# Altium schematic sheet EC800M_CN.SchDoc: EC800M_CN
size A3; ApprovedBy: TRAN VAN THANG; Author: MINH NHAT; Revision: 6.6.6; SheetNumber: 2; SheetTotal: 6; ProjectTitle: LOAPAY 4G WIFI
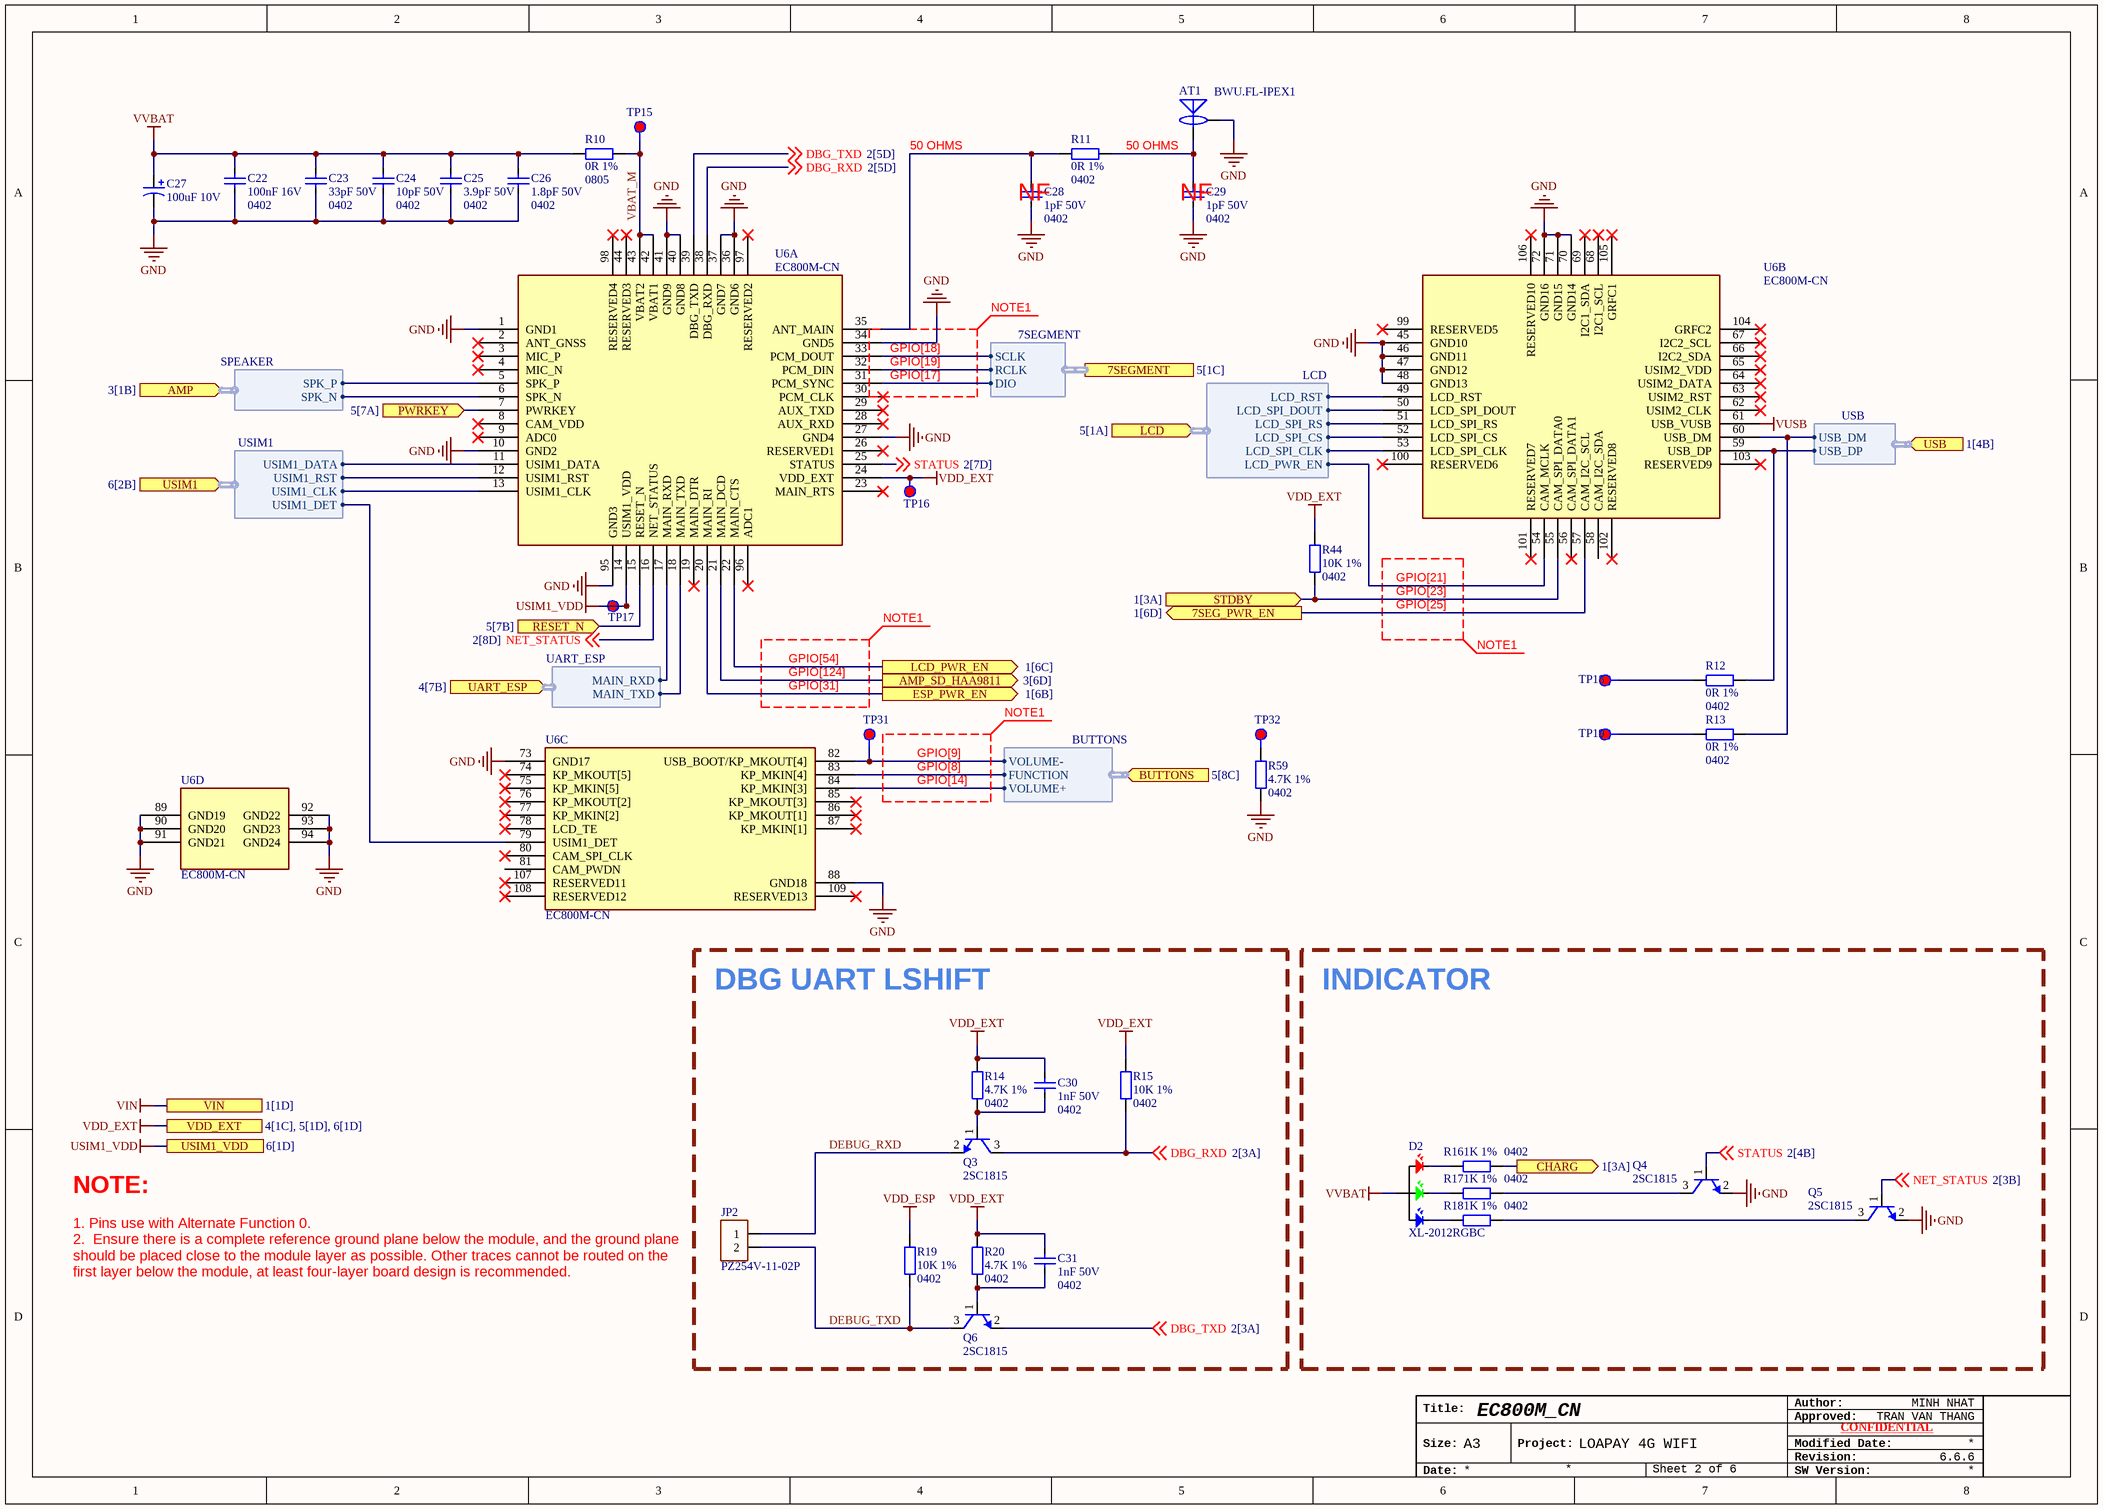
[diagram p0: EC800M_CN.SchDoc]

## Parts
AT1  BWU.FL-IPEX1  [IPEX-SMD_BWIPX-1-001E]
C22  100nF 16V  Package: 0402  [C0402_2]
C23  33pF 50V  Package: 0402  [C0402_2]
C24  10pF 50V  Package: 0402  [C0402_2]
C25  3.9pF 50V  Package: 0402  [C0402_2]
C26  1.8pF 50V  Package: 0402  [C0402_2]
C27  100uF 10V  [CAP-ALU-SMD-C-NEW]
C28  1pF 50V  Package: 0402  [C0402_2]
C29  1pF 50V  Package: 0402  [C0402_2]
C30  1nF 50V  Package: 0402  [C0402_2]
C31  1nF 50V  Package: 0402  [C0402_2]
D2  XL-2012RGBC  [LED-SMD_4P-L2.0-W1.3-BR]
JP2  PZ254V-11-02P  [JP2_M - 2]
Q3  2SC1815  [TF_SOT_23_3]
Q4  2SC1815  [TF_SOT_23_3]
Q5  2SC1815  [TF_SOT_23_3]
Q6  2SC1815  [TF_SOT_23_3]
R10  0R 1%  Package: 0805  [RES_SMD_0805]
R11  0R 1%  Package: 0402  [RES_SMD_0402]
R12  0R 1%  Package: 0402  [RES_SMD_0402]
R13  0R 1%  Package: 0402  [RES_SMD_0402]
R14  4.7K 1%  Package: 0402  [RES_SMD_0402]
R15  10K 1%  Package: 0402  [RES_SMD_0402]
R16  1K 1%  Package: 0402  [RES_SMD_0402]
R17  1K 1%  Package: 0402  [RES_SMD_0402]
R18  1K 1%  Package: 0402  [RES_SMD_0402]
R19  10K 1%  Package: 0402  [RES_SMD_0402]
R20  4.7K 1%  Package: 0402  [RES_SMD_0402]
R44  10K 1%  Package: 0402  [RES_SMD_0402]
R59  4.7K 1%  Package: 0402  [RES_SMD_0402]
TP15  Test Point  [TEST_POINT]  (value not drawn)  (no BOM)
TP16  Test Point  [TEST_POINT]  (value not drawn)  (no BOM)
TP17  Test Point  [TEST_POINT]  (value not drawn)  (no BOM)
TP18  Test Point  [TEST_POINT]  (value not drawn)  (no BOM)
TP19  Test Point  [TEST_POINT]  (value not drawn)  (no BOM)
TP31  Test Point  [TEST_POINT]  (value not drawn)  (no BOM)
TP32  Test Point  [TEST_POINT]  (value not drawn)  (no BOM)
U6  EC800M-CN  [ECM800-CN]  (parts A,B,C,D of 4)

## Blocks framed on the sheet
DBG UART LSHIFT: C30 C31 JP2 Q3 Q6 R14 R15 R19 R20
INDICATOR: D2 Q4 Q5 R16-R18

## Ports
7SEG_PWR_EN (out, see 1[6D]), 7SEGMENT (harness 7SEGMENT, see 5[1C]), AMP (in, harness SPEAKER, see 3[1B]), AMP_SD_HAA9811 (out, see 3[6D]), BUTTONS (in, harness BUTTONS, see 5[8C]), CHARG (out, see 1[3A]), ESP_PWR_EN (out, see 1[6B]), LCD (in, harness LCD, see 5[1A]), LCD_PWR_EN (out, see 1[6C]), PWRKEY (in, see 5[7A]), RESET_N (in, see 5[7B]), STDBY (in, see 1[3A]), UART_ESP (in, harness UART_ESP, see 4[7B]), USB (in, harness USB, see 1[4B]), USIM1 (in, harness USIM1, see 6[2B]), USIM1_VDD (see 6[1D]), VDD_EXT (see 4[1C], 5[1D], 6[1D]), VIN (see 1[1D])

## Harnesses
SPEAKER: SPK_P, SPK_N
USIM1: USIM1_DATA, USIM1_RST, USIM1_CLK, USIM1_DET
LCD: LCD_SPI_CLK, LCD_PWR_EN, LCD_SPI_CS, LCD_SPI_RS, LCD_SPI_DOUT, LCD_RST
UART_ESP: MAIN_RXD, MAIN_TXD
USB: USB_DM, USB_DP
7SEGMENT: SCLK, RCLK, DIO
BUTTONS: VOLUME+, FUNCTION, VOLUME-

## Nets
GND: AT1.2 C22.1 C23.1 C24.1 C25.1 C26.1 C27.2 C28.1 C29.1 Q4.2(E) Q5.2(E) R59.1 U6.1(GND1) U6.10(GND2) U6.27(GND4) U6.34(GND5) U6.36(GND6) U6.37(GND7) U6.40(GND8) U6.41(GND9) U6.45(GND10) U6.46(GND11) U6.47(GND12) U6.48(GND13) U6.70(GND14) U6.71(GND15) U6.72(GND16) U6.73(GND17) U6.88(GND18) U6.89(GND19) U6.90(GND20) U6.91(GND21) U6.92(GND22) U6.93(GND23) U6.94(GND24) U6.95(GND3)
USIM1_VDD: TP17.1 U6.14(USIM1_VDD) ; port USIM1_VDD
VDD_ESP: R19.2
VDD_EXT: C30.2 C31.2 R14.2 R15.2 R20.2 R44.2 TP16.1 U6.24(VDD_EXT) ; port VDD_EXT
VIN: port VIN
VUSB: U6.61(USB_VUSB)
VVBAT: C22.2 C23.2 C24.2 C25.2 C26.2 C27.1 D2.3 R10.1
7SEG_PWR_EN: U6.57(CAM_I2C_SCL) ; port 7SEG_PWR_EN
AMP_SD_HAA9811: U6.21(MAIN_DCD) ; port AMP_SD_HAA9811
CHARG: R16.1 ; port CHARG
DBG_RXD: Q3.3(C) R15.1 U6.38(DBG_RXD) ; off-sheet DBG_RXD
DBG_TXD: Q6.2(E) U6.39(DBG_TXD) ; off-sheet DBG_TXD
DEBUG_RXD: JP2.1 Q3.2(E)
DEBUG_TXD: JP2.2 Q6.3(C) R19.1
ESP_PWR_EN: U6.20(MAIN_RI) ; port ESP_PWR_EN
LCD_PWR_EN: U6.22(MAIN_CTS) ; port LCD_PWR_EN
NET_STATUS: Q5.1(B) U6.16(NET_STATUS) ; off-sheet NET_STATUS
PWRKEY: U6.7(PWRKEY) ; port PWRKEY
RESET_N: U6.15(RESET_N) ; port RESET_N
STATUS: Q4.1(B) U6.25(STATUS) ; off-sheet STATUS
STDBY: R44.1 U6.55(CAM_SPI_DATA0) ; port STDBY
VBAT_M: R10.2 TP15.1 U6.42(VBAT1) U6.43(VBAT2)
NetAT1_1: AT1.1 C29.2 R11.2
NetC28_2: C28.2 R11.1 U6.35(ANT_MAIN)
NetC30_1: C30.1 Q3.1(B) R14.1
NetC31_1: C31.1 Q6.1(B) R20.1
NetD2_1: D2.1 R16.2
NetD2_2: D2.2 R17.2
NetD2_4: D2.4 R18.2
NetQ4_3: Q4.3(C) R17.1
NetQ5_3: Q5.3(C) R18.1
NetR12_1: R12.1 TP18.1
NetR12_2: R12.2 U6.59(USB_DP) ; port USB.USB_DP
NetR13_1: R13.1 TP19.1
NetR13_2: R13.2 U6.60(USB_DM) ; port USB.USB_DM
NetR59_2: R59.2 TP32.1
NetTP31_1: TP31.1 U6.82(USB_BOOT/KP_MKOUT[4]) ; port BUTTONS.VOLUME-
NetU6_5: U6.5(SPK_P) ; port AMP.SPK_P
NetU6_6: U6.6(SPK_N) ; port AMP.SPK_N
NetU6_11: U6.11(USIM1_DATA) ; port USIM1.USIM1_DATA
NetU6_12: U6.12(USIM1_RST) ; port USIM1.USIM1_RST
NetU6_13: U6.13(USIM1_CLK) ; port USIM1.USIM1_CLK
NetU6_17: U6.17(MAIN_RXD) ; port UART_ESP.MAIN_RXD
NetU6_18: U6.18(MAIN_TXD) ; port UART_ESP.MAIN_TXD
NetU6_31: U6.31(PCM_SYNC) ; port 7SEGMENT.DIO
NetU6_32: U6.32(PCM_DIN) ; port 7SEGMENT.RCLK
NetU6_33: U6.33(PCM_DOUT) ; port 7SEGMENT.SCLK
NetU6_49: U6.49(LCD_RST) ; port LCD.LCD_RST
NetU6_50: U6.50(LCD_SPI_DOUT) ; port LCD.LCD_SPI_DOUT
NetU6_51: U6.51(LCD_SPI_RS) ; port LCD.LCD_SPI_RS
NetU6_52: U6.52(LCD_SPI_CS) ; port LCD.LCD_SPI_CS
NetU6_53: U6.53(LCD_SPI_CLK) ; port LCD.LCD_SPI_CLK
NetU6_54: U6.54(CAM_MCLK) ; port LCD.LCD_PWR_EN
NetU6_79: U6.79(USIM1_DET) ; port USIM1.USIM1_DET
NetU6_83: U6.83(KP_MKIN[4]) ; port BUTTONS.FUNCTION
NetU6_84: U6.84(KP_MKIN[3]) ; port BUTTONS.VOLUME+

Not connected (* = marked no-connect by the designer): U6 2(ANT_GNSS)* 3(MIC_P)* 4(MIC_N)* 8(CAM_VDD)* 9(ADC0)* 19(MAIN_DTR)* 23(MAIN_RTS)* 26(RESERVED1)* 28(AUX_RXD)* 29(AUX_TXD)* 30(PCM_CLK)* 44(RESERVED3)* 56(CAM_SPI_DATA1)* 58(CAM_I2C_SDA) 62(USIM2_CLK)* 63(USIM2_RST)* 64(USIM2_DATA)* 65(USIM2_VDD)* 66(I2C2_SDA)* 67(I2C2_SCL)* 68(I2C1_SCL)* 69(I2C1_SDA)* 74(KP_MKOUT[5])* 75(KP_MKIN[5])* 76(KP_MKOUT[2])* 77(KP_MKIN[2])* 78(LCD_TE)* 80(CAM_SPI_CLK)* 81(CAM_PWDN) 85(KP_MKOUT[3])* 86(KP_MKOUT[1])* 87(KP_MKIN[1])* 96(ADC1)* 97(RESERVED2)* 98(RESERVED4)* 99(RESERVED5)* 100(RESERVED6)* 101(RESERVED7)* 102(RESERVED8)* 103(RESERVED9)* 104(GRFC2)* 105(GRFC1)* 106(RESERVED10)* 107(RESERVED11)* 108(RESERVED12)* 109(RESERVED13)*

## Notes on the sheet
- 50 OHMS
- (near C28) NF
- (near C29) NF
- NOTE1
- (near U6) GPIO[18]
- (near U6) GPIO[19]
- (near U6) GPIO[17]
- GPIO[21]
- GPIO[23]
- GPIO[25]
- GPIO[54]
- GPIO[124]
- GPIO[31]
- (near TP31) GPIO[9]
- GPIO[8]
- GPIO[14]
- NOTE:
- 1. Pins use with Alternate Function 0.
  2.  Ensure there is a complete reference ground plane below the module, and the ground plane should be placed close to the module layer as possible. Other traces cannot be routed on the first layer below the module, at least four-layer board design is recommended.
- Author:
- Title:
- Size:
- A3
- Project:
- Approved:
- Revision:
- Modified Date:
- CONFIDENTIAL
- Date:
- SW Version:

## Library data of the parts
AT1 = BAT WIRELESS BWU.FL-IPEX1: 1 Inner pin IPEX Board-End 1.25mm 6GHz 50Ω 2mm SMD Coaxial Connectors (RF) ROHS; Manufacturer: BAT WIRELESS; Manufacture Part Number: BWU.FL-IPEX1; Packaging: Cut Tape; Package: SMD; Link: https://www.lcsc.com/product-detail/Coaxial-Connectors-RF_BAT-WIRELESS-BWU-FL-IPEX1_C5137195.html?s_z=n_IPEX; LCSC Part: C5137195
C22 = C0402_MLCC_100nF_16V: 16V 100nF X7R ±10% 0402 Multilayer Ceramic Capacitors MLCC - SMD/SMT ROHS; Manufacturer: YAGEO; Manufacture Part Number: CC0402KRX7R7BB104; Packaging: Cut Tape (CT); Tolerance: ±10%; Link: https://www.lcsc.com/product-detail/Multilayer-Ceramic-Capacitors-MLCC-SMD-SMT_YAGEO-CC0402KRX7R7BB104_C60474.html?s_z=n_0402%20100nF; LCSC Part: C60474
C23 = C0402_MLCC_33pF_50V: 50V 33pF NP0 ±5% 0402 Multilayer Ceramic Capacitors MLCC - SMD/SMT ROHS; Manufacturer: YAGEO; Manufacture Part Number: CC0402JRNPO9BN330; Packaging: Cut Tape (CT); Tolerance: ±5%; Link: https://www.lcsc.com/product-detail/Multilayer-Ceramic-Capacitors-MLCC-SMD-SMT_YAGEO-CC0402JRNPO9BN330_C107005.html?s_z=n_0402%2033Pf; LCSC Part: C107005
C24 = C0402_MLCC_10pF_50V: 50V 10pF C0G ±5% 0402 Multilayer Ceramic Capacitors MLCC - SMD/SMT ROHS; Manufacturer: VIIYONG; Manufacture Part Number: V100J0402C0G500NBT; Packaging: Cut Tape (CT); Tolerance: ±5%; Link: https://www.lcsc.com/product-detail/Multilayer-Ceramic-Capacitors-MLCC-SMD-SMT_VIIYONG-V100J0402C0G500NBT_C513437.html?s_z=n_0402%2010p; LCSC Part: C513437
C25 = C0402_MLCC_3.9pF_50V: 50V 3.9pF NP0 0402 Multilayer Ceramic Capacitors MLCC - SMD/SMT ROHS; Manufacturer: YAGEO; Manufacture Part Number: CC0402BRNPO9BN3R9; Tolerance: ±0.1pF; Packaging: Cut Tape (CT); Link: https://www.lcsc.com/product-detail/Multilayer-Ceramic-Capacitors-MLCC-SMD-SMT_YAGEO-CC0402BRNPO9BN3R9_C505474.html?s_z=n_0402%203.9p; LCSC Part: C505474
C26 = C0402_MLCC_1.8pF_50V: 50V 1.8pF C0G 0402 Multilayer Ceramic Capacitors MLCC - SMD/SMT ROHS; Manufacturer: Murata Electronics; Manufacture Part Number: GJM1555C1H1R8WB01D; Tolerance: ±0.05pF; Packaging: Cut Tape (CT); Link: https://www.lcsc.com/product-detail/Multilayer-Ceramic-Capacitors-MLCC-SMD-SMT_Murata-Electronics-GJM1555C1H1R8WB01D_C76903.html?s_z=n_0402%201.8p; LCSC Part: C76903
C27 = C_ALU_100uF_10V_C: 100uF 10V 49mA@120Hz ±20% SMD,D5xL5.4mm Aluminum Electrolytic Capacitors - SMD ROHS; Manufacturer: ROQANG; Manufacture Part Number: CS1A101M-CRD54; Packaging: Cut Tape (CT); Package: SMD,D5xL5.4mm; Tolerance: ±20%; Link: https://www.lcsc.com/product-detail/Aluminum-Electrolytic-Capacitors-SMD_ROQANG-CS1A101M-CRD54_C3001205.html?s_z=n_C3001205; LCSC Part: C3001205
C28 C29 = C0402_MLCC_1pF_50V: 50V 1pF NP0 0402 Multilayer Ceramic Capacitors MLCC - SMD/SMT ROHS; Manufacturer: Walsin Tech Corp; Manufacture Part Number: 0402N1R0B500CT; Tolerance: ±0.1pF; Packaging: Cut Tape (CT); Link: https://www.lcsc.com/product-detail/Multilayer-Ceramic-Capacitors-MLCC-SMD-SMT_Walsin-Tech-Corp-0402N1R0B500CT_C301966.html?s_z=n_0402%201pF; LCSC Part: C301966
C30 C31 = C0402_MLCC_1nF_50V: 50V 1nF X7R ±10% 0402 Multilayer Ceramic Capacitors MLCC - SMD/SMT ROHS; Manufacturer: Murata Electronics; Manufacture Part Number: GCM155R71H102KA37J; Packaging: Cut Tape (CT); Tolerance: ±10%; ComponentLink1Description: Link LCSC; Link: https://www.lcsc.com/product-detail/Multilayer-Ceramic-Capacitors-MLCC-SMD-SMT_Murata-Electronics-GCM155R71H102KA37J_C1852263.html?s_z=n_1nF%200402; LCSC Part: C1852263
D2 = XL-2012RGBC: 0805 RGB LEDs ROHS; Manufacturer: XINGLIGHT; Manufacture Part Number: XL-2012RGBC; Packaging: Cut Tape (CT); Link: https://lcsc.com/product-detail/RGB-LEDs_XINGLIGHT-XL-2012RGBC_C965848.html?s_z=n_RGB%2520LEDS; Package: 0805; LCSC Part: C965848
JP2 = PZ254V-11-02P: Straight Policy 2.5mm 2P 6mm -40℃~+105℃ 3mm 2.54mm Single Row Black Brass 1x2P Plugin,P=2.54mm Pin Headers ROHS; Manufacturer: XFCN; Manufacture Part Number: PZ254V-11-02P; Packaging: Cut Tape; Link: https://www.lcsc.com/product-detail/Pin-Headers_XFCN-PZ254V-11-02P_C492401.html?s_z=n_PZ254-11-02P; Package: Push-Pull,P=2.54mm; LCSC Part: C492401
Q3-Q6 = 2SC1815: 50V 200mW 200@2mA,6V 150mA NPN SOT-23 Bipolar (BJT) ROHS; Manufacturer: Guangdong Hottech; Current - Collector Cutoff: 100nA; Transition frequency(fT): 80MHz; Vce Saturation(VCE(sat)): 250mV; Manufacture Part Number: 2SC1815; Packaging: Cut Tape (CT); Link: https://www.lcsc.com/product-detail/Bipolar-BJT_Guangdong-Hottech-2SC1815_C181171.html?s_z=n_c1815; Collector - Emitter Voltage VCEO: 50V; Pd - Power Dissipation: 200mW; DC Current Gain: 200@2mA,6V; Current - Collector(Ic): 150mA; Package: SOT-23-3; LCSC Part: C181171
R10 = R0805_0R: 0 Ohms Jumper Chip Resistor 0805 (2012 Metric) Moisture Resistant Thick Film; Manufacturer: YAGEO; Manufacture Part Number: RC0805JR-070RL; Packaging: Cut Tape (CT); Link: https://www.lcsc.com/product-detail/Chip-Resistor-Surface-Mount_YAGEO-RC0805JR-070RL_C96345.html?s_z=n_RC0805JR-070RL; Tolerance: ±1%; Link Digikey: https://www.digikey.com/en/products/detail/yageo/RC0805JR-070RL/728216; LCSC Part: C96345
R11-R13 = R0402_0R: 0 Ohms Jumper Chip Resistor 0402 (1005 Metric) Moisture Resistant Thick Film; Manufacturer: YAGEO; Manufacture Part Number: RC0402JR-070RL; Packaging: Cut Tape (CT); Link: https://www.lcsc.com/product-detail/Chip-Resistor-Surface-Mount_YAGEO-RC0402JR-070RL_C60485.html?s_z=n_RC0402JR-070RL; Tolerance: ±1%; Link Digikey: https://www.digikey.com/en/products/detail/yageo/RC0402JR-070RL/726406; LCSC Part: C60485
R14 R20 R59 = R0402_4.7K: 4.7 kOhms ±1% 0.063W, 1/16W Chip Resistor 0402 (1005 Metric) Thick Film; Manufacturer: YAGEO; Manufacture Part Number: RC0402FR-074K7P; Packaging: Cut Tape (CT); Link: https://www.lcsc.com/product-detail/Chip-Resistor-Surface-Mount_YAGEO-RC0402FR-074K7P_C851841.html?s_z=n_RC0402FR-074K7P; Tolerance: ±1%; Link Digikey: https://www.digikey.com/en/products/detail/yageo/RC0402FR-074K7P/4935287; LCSC Part: C851841
R15 R19 R44 = R0402_10K: 10 kOhms ±1% 0.063W, 1/16W Chip Resistor 0402 (1005 Metric) Moisture Resistant Thick Film; Manufacturer: YAGEO; Manufacture Part Number: RC0402FR-0710KL; Packaging: Cut Tape (CT); Link: https://www.lcsc.com/product-detail/Chip-Resistor-Surface-Mount_YAGEO-RC0402FR-0710KL_C60490.html?s_z=n_RC0402FR-0710KL; Tolerance: ±1%; Link Digikey: https://www.digikey.com/en/products/detail/yageo/RC0402FR-0710KL/726523; LCSC Part: C60490
R16-R18 = R0402_1K: 1 kOhms ±1% 0.063W, 1/16W Chip Resistor 0402 (1005 Metric) Moisture Resistant Thick Film; Manufacturer: YAGEO; Manufacture Part Number: RC0402FR-071KL; Packaging: Cut Tape (CT); Link Digikey: https://www.digikey.com/en/products/detail/yageo/RC0402FR-071KL/726513; Tolerance: ±1%; LCSC Part: C106235; Link: https://www.lcsc.com/product-detail/Chip-Resistor-Surface-Mount_YAGEO-RC0402FR-071KL_C106235.html?s_z=n_RC0402FR-071KL
TP15-TP19 TP31 TP32 = TEST_POINT
U6 = EC800M-CN: IoT/ M2M-optimized / LTE Cat 1 Module; Manufacturer: Quectel; Supply Voltage Range: 3.4~4.3 V，typ. 3.8 V; Interface Type: TCP/ UDP/ PPP/ NTP/ NITZ/ FTP/ HTTP/ PING/ CMUX*/ HTTPS/ FTPS/ SSL/ FILE/ MQTT/ MMS*/ SMTP*/; Manufacture Part Number: EC800M-CN; Link: https://www.quectel.com.cn/product/ec800m-cn; Package: LCC